# EAGLE schematic MOM-analog-ins_v06 (EAGLE 8.1.0)
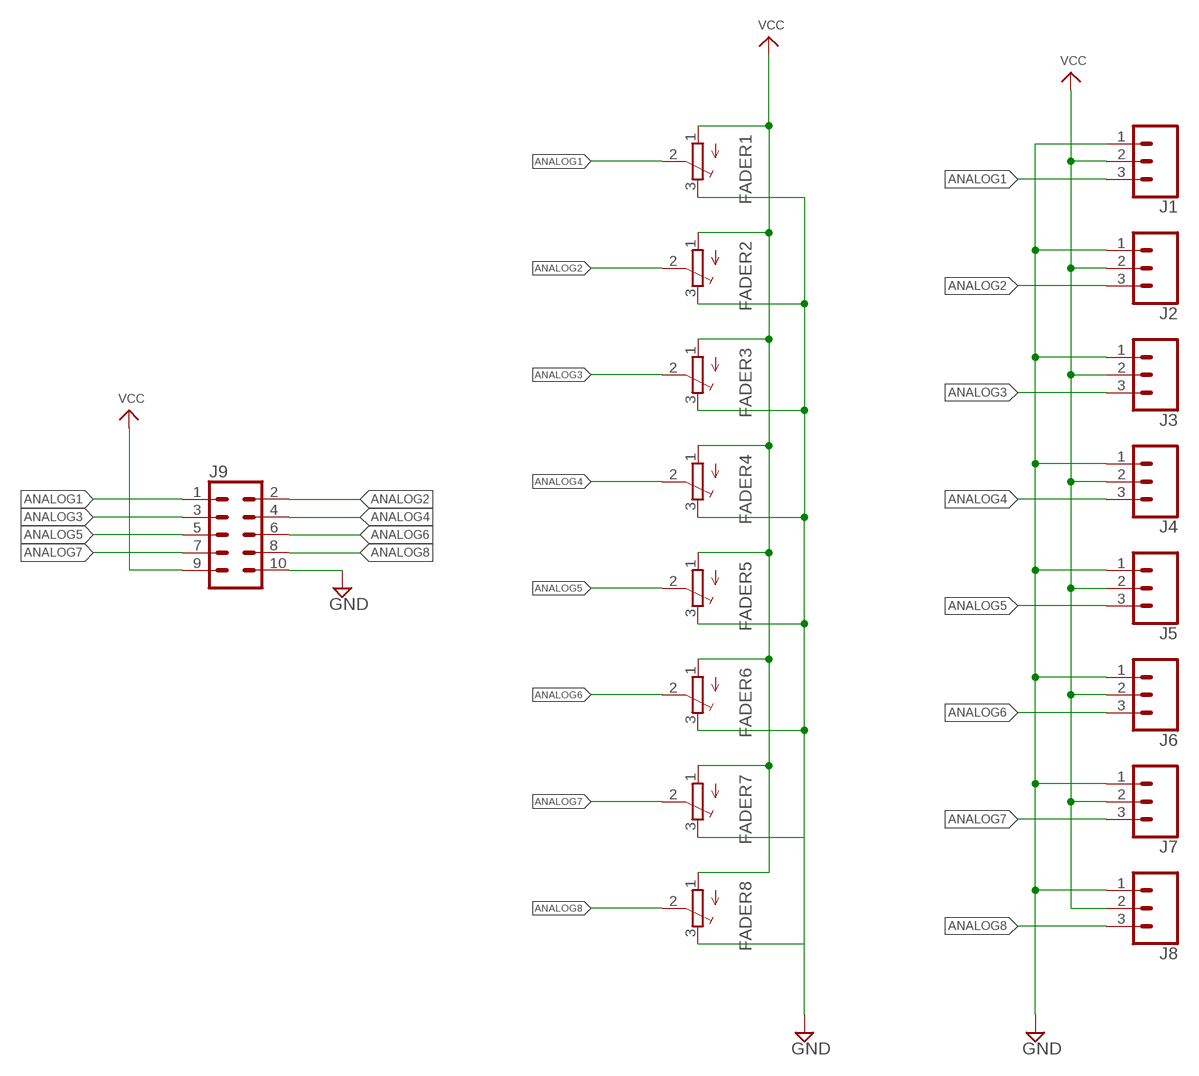
[diagram p0: schematic, sheet 1]

## Parts
FADER1  TRIMPOT3386  [TRIM-3386]
FADER2  TRIMPOT3386  [TRIM-3386]
FADER3  TRIMPOT3386  [TRIM-3386]
FADER4  TRIMPOT3386  [TRIM-3386]
FADER5  TRIMPOT3386  [TRIM-3386]
FADER6  TRIMPOT3386  [TRIM-3386]
FADER7  TRIMPOT3386  [TRIM-3386]
FADER8  TRIMPOT3386  [TRIM-3386]
J1  CONN_03LOCK  [1X03_LOCK]
J2  CONN_03LOCK  [1X03_LOCK]
J3  CONN_03LOCK  [1X03_LOCK]
J4  CONN_03LOCK  [1X03_LOCK]
J5  CONN_03LOCK  [1X03_LOCK]
J6  CONN_03LOCK  [1X03_LOCK]
J7  CONN_03LOCK  [1X03_LOCK]
J8  CONN_03LOCK  [1X03_LOCK]
J9  CONN_05X2SHD_LOCK  [2X5-SHROUDED_LOCK]

## Nets
ANALOG1: FADER1.2(S) J1.3 J9.1
ANALOG2: FADER2.2(S) J2.3 J9.2
ANALOG3: FADER3.2(S) J3.3 J9.3
ANALOG4: FADER4.2(S) J4.3 J9.4
ANALOG5: FADER5.2(S) J5.3 J9.5
ANALOG6: FADER6.2(S) J6.3 J9.6
ANALOG7: FADER7.2(S) J7.3 J9.7
ANALOG8: FADER8.2(S) J8.3 J9.8
GND: FADER1.3(E) FADER2.3(E) FADER3.3(E) FADER4.3(E) FADER5.3(E) FADER6.3(E) FADER7.3(E) FADER8.3(E) J1.1 J2.1 J3.1 J4.1 J5.1 J6.1 J7.1 J8.1 J9.10
VCC: FADER1.1(A) FADER2.1(A) FADER3.1(A) FADER4.1(A) FADER5.1(A) FADER6.1(A) FADER7.1(A) FADER8.1(A) J1.2 J2.2 J3.2 J4.2 J5.2 J6.2 J7.2 J8.2 J9.9

## Library data of the parts
FADER1-FADER8 = adafruit:TRIMPOT: SMT trimmer potentiometer part number TC33X http://www.ladyada.net/library/eagle
J1-J8 = SparkFun-Connectors:CONN_03: Multi connection point. Often used as Generic Header-pin footprint for 0.1 inch spaced/style header connections On any of the 0.1 inch spaced packages, you can populate with these: Break Away Headers - Straight <https://www.sparkfun.com/products/116> (PRT-00116) Break Away Male Headers - Right Angle <https://www.sparkfun.com/products/553> (PRT-00553) Female Headers <https://www.sparkfun.com/products/115> (PRT-00115) Break Away Headers - Machine Pin <https://www.sparkfun.com/products/117> (PRT-00117) Break Away Female Headers - Swiss Machine Pin <https://www.sparkfun.com/products/743> (PRT-00743) Stackable Header - 3 Pin (Female, 0.1") <https://www.sparkfun.com/products/13875> (PRT-13875) For SCREWTERMINALS and SPRING TERMINALS visit here: Screw Terimnals on SparkFun.com <https://www.sparkfun.com/search/results?term=Screw+Terminals> (5mm/3.5mm/2.54mm spacing) This device is also useful as a general connection point to wire up your design to another part of your project. Our various solder wires solder well into these plated through hole pads. Hook-Up Wire - Assortment (Stranded, 22 AWG) <https://www.sparkfun.com/products/11375> (PRT-11375) Hook-Up Wire - Assortment (Solid Core, 22 AWG) <https://www.sparkfun.com/products/11367> (PRT-11367) View the entire wire category on our website here <https://www.sparkfun.com/categories/141> Special notes: Molex polarized connector foot print use with SKU : PRT-08232 with associated crimp pins and housings.
J9 = SparkFun-Connectors:CONN_05X2: Multi connection point. Often used as Generic Header-pin footprint for 0.1 inch spaced/style header connections For AVR SPI programming port, see special device with nice symbol: "AVR_SPI_PROG_5x2.dev" You can populate with any combo of single row headers, but if you'd like an exact match, check these: 2x5 AVR ICSP Male Header <https://www.sparkfun.com/products/778> (PRT-00778) 2x5 Pin Shrouded Header <https://www.sparkfun.com/products/8506> (PRT-08506) On any of the 0.1 inch spaced packages, you can populate with these: Break Away Headers - Straight <https://www.sparkfun.com/products/116> (PRT-00116) Break Away Male Headers - Right Angle <https://www.sparkfun.com/products/553> (PRT-00553) Female Headers <https://www.sparkfun.com/products/115> (PRT-00115) Break Away Headers - Machine Pin <https://www.sparkfun.com/products/117> (PRT-00117) Break Away Female Headers - Swiss Machine Pin <https://www.sparkfun.com/products/743> (PRT-00743) Special note: the shrouded connector mates well with our 5x2 ribbon cables: 2x5 Pin IDC Ribbon Cable <https://www.sparkfun.com/products/8535> (PRT-08535); PROD_ID: CONN-08671; SF_ID: PRT-08506

## Net classes
0 default: width 0.254 mm, clearance 0.152 mm